# Altium schematic sheet UserInteractive.SchDoc: =ProjectTitle
size B; Engineer: H. Collector; Organization: IMR Engineering; Address1: 3621 Gin Way; Address2: Snellville, GA 30039; Address3: USA; SheetNumber: 7; SheetTotal: 10
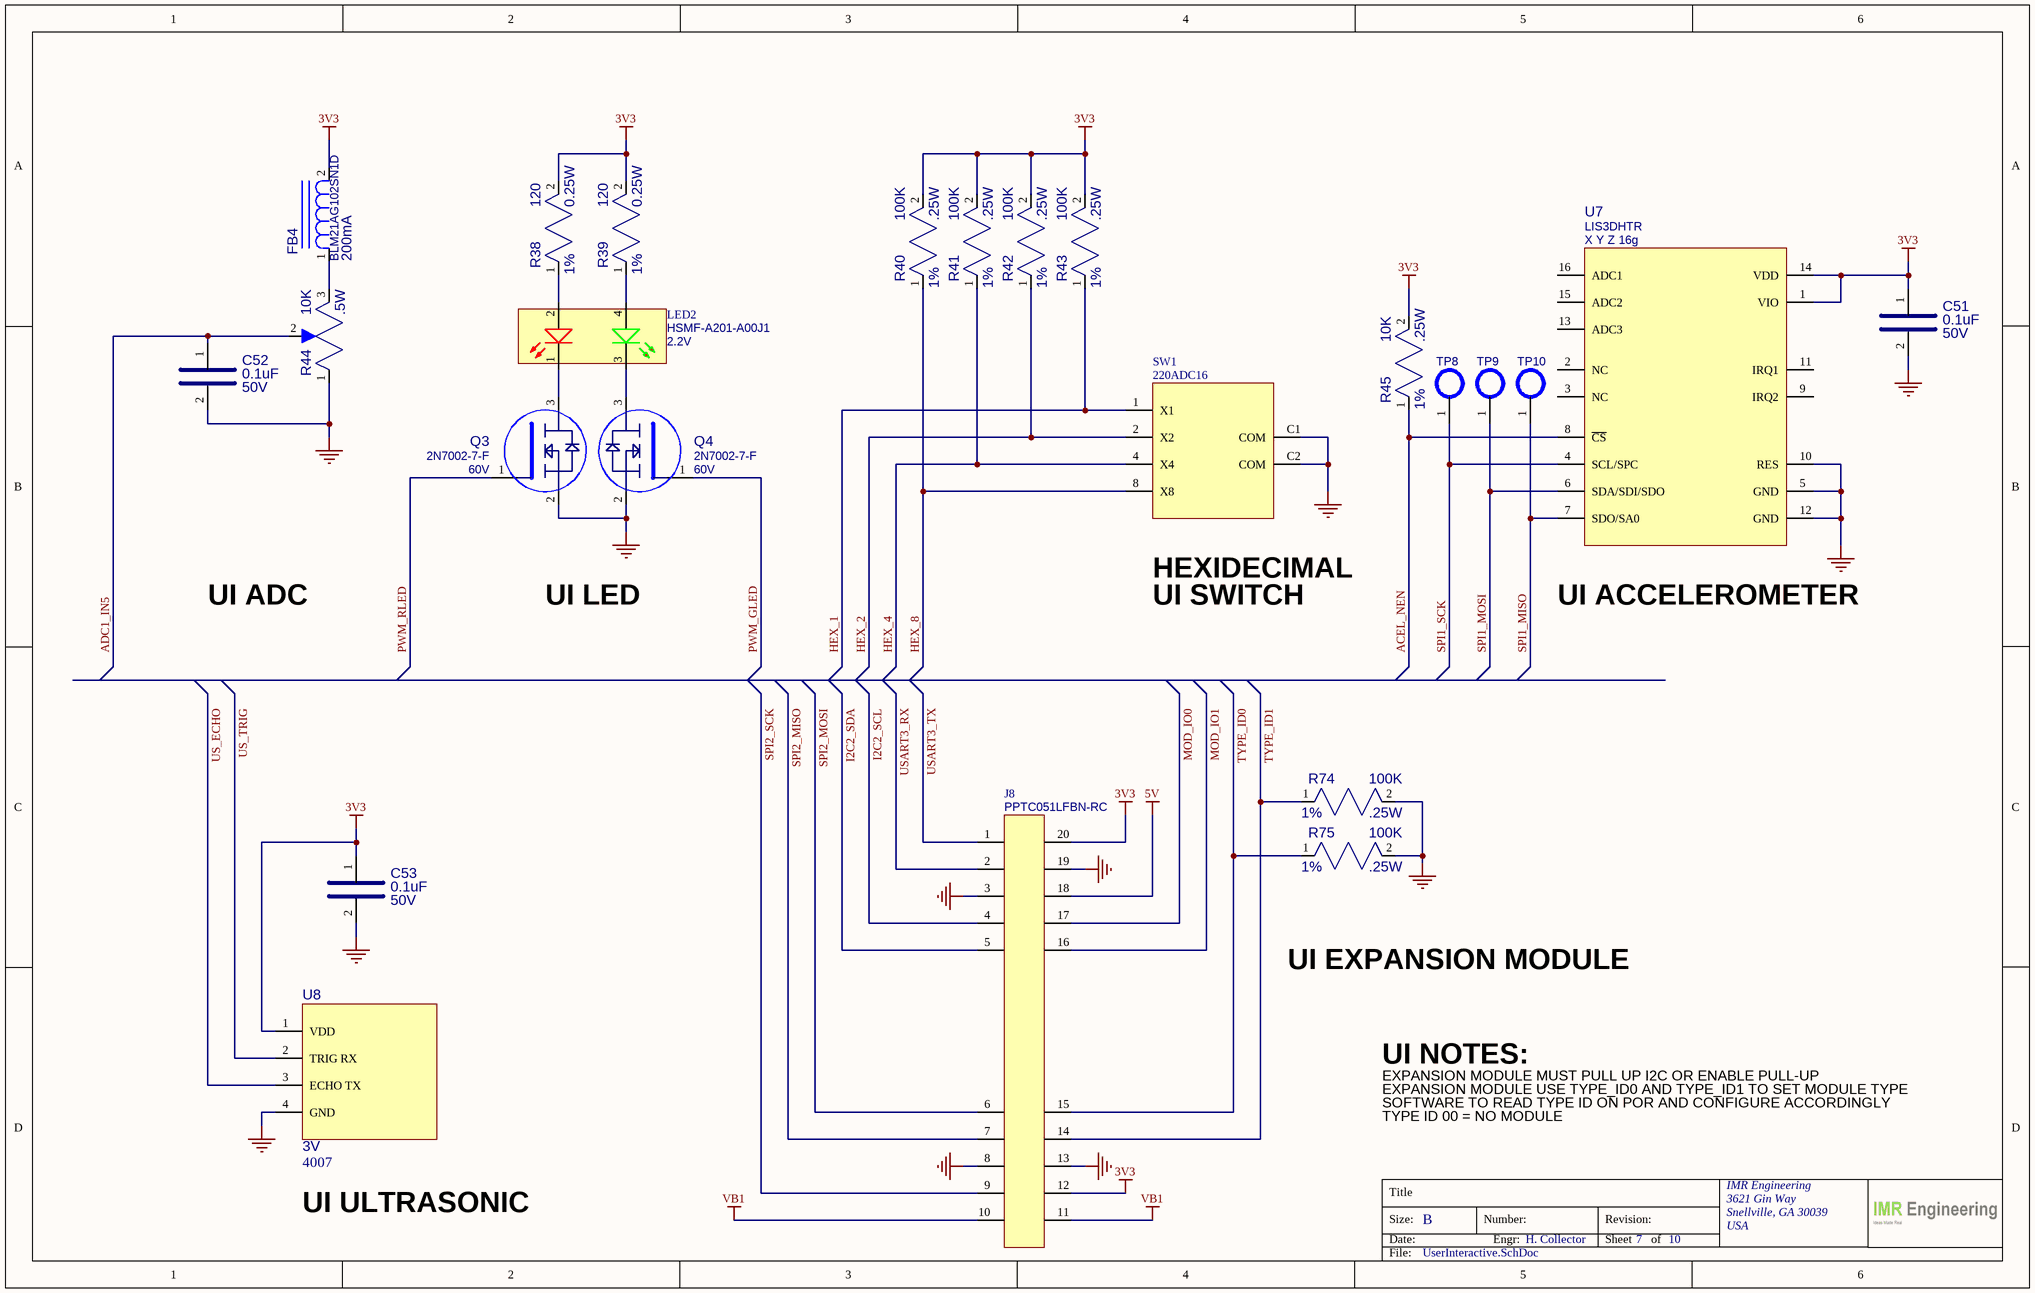
[diagram p0: UserInteractive.SchDoc]

## Parts
C51  value 0.1uF  VOLTAGE: 50V  [CAP_0805]  (hidden comment: 08055C104KAT2A)
C52  value 0.1uF  VOLTAGE: 50V  [CAP_0805]  (hidden comment: 08055C104KAT2A)
C53  value 0.1uF  VOLTAGE: 50V  [CAP_0805]  (hidden comment: 08055C104KAT2A)
FB4  value 200mA  [RES_0805]  (hidden comment: BLM21AG102SN1D)
J8  PPTC051LFBN-RC  [CONN_EXPANSION_BOARD]
LED2  value 2.2V  [4PLCC-LED]  (hidden comment: HSMF-A201-A00J1)
Q3  value 60V  [SOT-23]  (hidden comment: 2N7002-7-F)
Q4  value 60V  [SOT-23]  (hidden comment: 2N7002-7-F)
R38  value 120  TOLERANCE: 1%  POWER: 0.25W  [PMG_RES_0805]  (hidden comment: RK73H2ATTD1200F)
R39  value 120  TOLERANCE: 1%  POWER: 0.25W  [PMG_RES_0805]  (hidden comment: RK73H2ATTD1200F)
R40  value 100K  TOLERANCE: 1%  POWER: .25W  [PMG_RES_0805]  (hidden comment: RK73H2ATTD1003F)
R41  value 100K  TOLERANCE: 1%  POWER: .25W  [PMG_RES_0805]  (hidden comment: RK73H2ATTD1003F)
R42  value 100K  TOLERANCE: 1%  POWER: .25W  [PMG_RES_0805]  (hidden comment: RK73H2ATTD1003F)
R43  value 100K  TOLERANCE: 1%  POWER: .25W  [PMG_RES_0805]  (hidden comment: RK73H2ATTD1003F)
R44  value 10K  POWER: .5W  [BOURNS_3386F]  (hidden comment: 3386F-1-103TLF)
R45  value 10K  TOLERANCE: 1%  POWER: .25W  [RES_0805]  (hidden comment: SG73S2ATTD1002F)
R74  value 100K  TOLERANCE: 1%  POWER: .25W  [PMG_RES_0805]  (hidden comment: RK73H2ATTD1003F)
R75  value 100K  TOLERANCE: 1%  POWER: .25W  [PMG_RES_0805]  (hidden comment: RK73H2ATTD1003F)
SW1  220ADC16  [CTS_220ADC16]
TP8  TP_0635MM_HOLE  [TP_0635MM_HOLE]  (value not drawn)  (no BOM)
TP9  TP_0635MM_HOLE  [TP_0635MM_HOLE]  (value not drawn)  (no BOM)
TP10  TP_0635MM_HOLE  [TP_0635MM_HOLE]  (value not drawn)  (no BOM)
U7  value X Y Z 16g  [XDCR_LIS3DHTR]  (hidden comment: LIS3DHTR)
U8  value 3V  [4007]  (hidden comment: 4007)

## Nets
3V3: C51.1 C53.1 FB4.2 J8.12 J8.20 R38.2 R39.2 R40.2 R41.2 R42.2 R43.2 R45.2 U7.1(VIO) U7.14(VDD) U8.1(VDD)
5V: J8.18
GND: C51.2 C52.2 C53.2 J8.3 J8.8 J8.13 J8.19 Q3.2(E) Q4.2(E) R44.1 R74.2 R75.2 SW1.C1(COM) SW1.C2(COM) U7.5(GND) U7.10(RES) U7.12(GND) U8.4(GND)
VB1: J8.10 J8.11
ACEL_NEN: R45.1 U7.8(~{CS})
ADC1_IN5: C52.1 R44.2
HEX_1: R43.1 SW1.1(X1)
HEX_2: R42.1 SW1.2(X2)
HEX_4: R41.1 SW1.4(X4)
HEX_8: R40.1 SW1.8(X8)
I2C2_SCL: J8.4
I2C2_SDA: J8.5
MOD_IO0: J8.17
MOD_IO1: J8.16
PWM_GLED: Q4.1(B)
PWM_RLED: Q3.1(B)
SPI1_MISO: TP10.1 U7.7(SDO/SA0)
SPI1_MOSI: TP9.1 U7.6(SDA/SDI/SDO)
SPI1_SCK: TP8.1 U7.4(SCL/SPC)
SPI2_MISO: J8.7
SPI2_MOSI: J8.6
SPI2_SCK: J8.9
TYPE_ID0: J8.15 R75.1
TYPE_ID1: J8.14 R74.1
US_ECHO: U8.3(ECHO_TX)
US_TRIG: U8.2(TRIG_RX)
USART3_RX: J8.2
USART3_TX: J8.1
NetFB4_1: FB4.1 R44.3
NetLED2_1: LED2.1(K) Q3.3(C)
NetLED2_2: LED2.2(A) R38.1
NetLED2_3: LED2.3(K) Q4.3(C)
NetLED2_4: LED2.4(A) R39.1

Not connected (* = marked no-connect by the designer): U7 2(NC) 3(NC) 9(IRQ2) 11(IRQ1) 13(ADC3) 15(ADC2) 16(ADC1)

## Notes on the sheet
- UI ADC
- UI LED
- UI SWITCH
- HEXIDECIMAL
- UI ACCELEROMETER
- UI EXPANSION MODULE
- EXPANSION MODULE MUST PULL UP I2C OR ENABLE PULL-UP
- UI NOTES:
- EXPANSION MODULE USE TYPE_ID0 AND TYPE_ID1 TO SET MODULE TYPE
- SOFTWARE TO READ TYPE ID ON POR AND CONFIGURE ACCORDINGLY
- TYPE ID 00 = NO MODULE
- UI ULTRASONIC
- Title
- Size:
- Date:
- B
- Number:
- Engr:
- Revision:
- Sheet
- of
- File:

## Library data of the parts
C51-C53 = CAP_0.1UF_50V_0805: CAP CER 0.1UF 50V X7R 0805; MFG: AVX; TOLERANCE: 10%; MFG_PN: 08055C104KAT2A; Supplier 1: Digi-Key; Supplier Part Number 1: 478-1395-1-ND; Case/Package: 0805
  C51: ClassName: UI_Accelerometer
  C52: ClassName: UI_ADC
  C53: ClassName: UI_UltraSonic
FB4 = FERRITE_BLM21AG102SN1D: FERRITE, 1KOHM AT 100MHZ, 220MA, .450DCR; MFG: MURATA; TOLERANCE: 10%; Supplier 1: Digi-Key; Supplier Part Number 1: 490-1041-1-ND; MFG_PN: BLM21AG102SN1D; ClassName: UI_ADC
J8 = CONN_TD_EXPANSION_MODULE: CONN HEADER VERT 5POS 2.54MM (NOTE: QTY x4); MFG: Sullins Connector Solutions; Case/Package: EXP_SLOT; MFG_PN: PPTC051LFBN-RC; Supplier 1: Digi-Key; Supplier Part Number 1: S6103-ND; Value: x4; ClassName: UI_Module
LED2 = LED_RED_GREEN_HSMF-A201-A00J1: LED GREEN/RED CLEAR 4PLCC SMD; MFG: Broadcom Limited; Case/Package: 4PLCC; Supplier 1: Digi-Key; Supplier Part Number 1: 516-2491-1-ND; MFG_PN: HSMF-A201-A00J1; ClassName: UI_LED
Q3 Q4 = MOSFET_NCH_2N7002-7-F: MOSFET N-CH 60V 115MA SOT23-3; MFG: Diodes Incorporated; Case/Package: SOT-23; Supplier 1: Digi-Key; Supplier Part Number 1: 2N7002-FDICT-ND; MFG_PN: 2N7002-7-F; ClassName: UI_LED
R38 R39 = RES_120_0805_1/4W_1%: RES 120 OHM 1% 1/4W 0805; MFG: KOA Speer Electronics, Inc.; Case/Package: 0805; MFG_PN: RK73H2ATTD1200F; Supplier 1: Digi-Key; Supplier Part Number 1: 2019-RK73H2ATTD1200FCT-ND; ClassName: UI_LED
R40-R43 R74 R75 = RES_100K_0805_1/4W_1%: RES SMD 100K OHM 1% 1/4W 0805; MFG: KOA Speer Electronics, Inc.; Case/Package: 0805; MFG_PN: RK73H2ATTD1003F; Supplier 1: Digi-Key; Supplier Part Number 1: 2019-RK73H2ATTD1003FCT-ND
  R40-R43: ClassName: UI_HexSwitch
  R74 R75: ClassName: UI_Module
R44 = RES_POT_10K_500mW: TRIMMER 10K OHM 0.5W PC PIN TOP; MFG: Bourns Inc.; Case/Package: PIN TOP; MFG_PN: 3386F-1-103TLF; Supplier 1: Digi-Key; Supplier Part Number 1: 3386F-103TLF-ND; ClassName: UI_ADC
R45 = RES_10K_0805_1/4W_1%: RES SMD 10K OHM 1% 1/4W 0805; MFG: KOA Speer Electronics, Inc.; Case/Package: 0805; MFG_PN: SG73S2ATTD1002F; Supplier 1: Digi-Key; Supplier Part Number 1: 2019-SG73S2ATTD1002FCT-ND; ClassName: UI_Accelerometer
SW1 = SW_DIP_220ADC16: SWITCH ROTARY DIP HEX 100MA 50V; MFG: CTS Electrocomponents; MFG_PN: 220ADC16; Supplier 1: DigiKey; Supplier Part Number 1: CT3070-ND; Value: HEX; Case/Package: 220ADC16; ClassName: UI_HexSwitch
TP8-TP10 = TP_0635MM_HOLE: 3MM IN D. MT HOLE
U7 = IC_LIS3DHTR: ACCEL 2-16G I2C/SPI 16LGA; MFG: STMicroelectronics; MFG_PN: LIS3DHTR; Supplier 1: Digi-Key; Supplier Part Number 1: 497-10613-1-ND; ClassName: UI_Accelerometer
U8 = MODULE_RCWL-1601: MODULE ULTRASONIC SENSOR 3V; MFG: Adafruit Industries LLC; Case/Package: 4007; Supplier 1: Digi-Key; Supplier Part Number 1: 1528-2832-ND; MFG_PN: 4007; ClassName: UI_UltraSonic